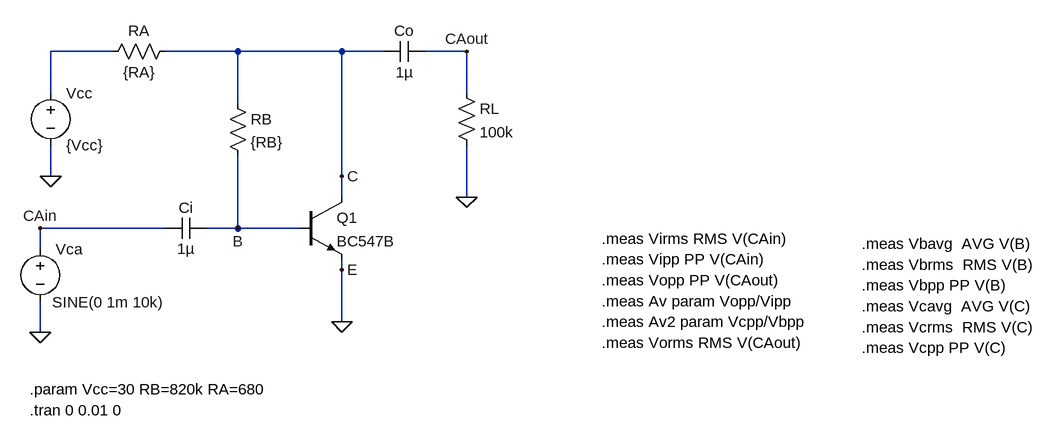
[diagram p0: schematic TBJ04CA.asc]
TBJ04CA.asc, the LTspice schematic file:
Version 4
SHEET 1 1608 1200
WIRE -64 -16 -160 -16
WIRE 128 -16 16 -16
WIRE 288 -16 128 -16
WIRE 352 -16 288 -16
WIRE 480 -16 416 -16
WIRE -160 48 -160 -16
WIRE 480 48 480 -16
WIRE 128 64 128 -16
WIRE -160 176 -160 128
WIRE 288 176 288 -16
WIRE 288 208 288 176
WIRE 480 208 480 128
WIRE 16 256 -176 256
WIRE 128 256 128 144
WIRE 128 256 80 256
WIRE 224 256 128 256
WIRE -176 288 -176 256
WIRE 288 320 288 304
WIRE 288 400 288 320
WIRE -176 416 -176 368
FLAG -160 176 0
FLAG 288 400 0
FLAG -176 416 0
FLAG -176 256 CAin
FLAG 480 208 0
FLAG 480 -16 CAout
FLAG 128 256 B
FLAG 288 176 C
FLAG 288 320 E
SYMBOL res 112 48 R0
SYMATTR InstName RB
SYMATTR Value {RB}
SYMBOL voltage -160 32 R0
WINDOW 123 0 0 Left 0
WINDOW 39 0 0 Left 0
SYMATTR InstName Vcc
SYMATTR Value {Vcc}
SYMBOL npn 224 208 R0
SYMATTR InstName Q1
SYMATTR Value BC547B
SYMBOL cap 80 240 R90
WINDOW 0 0 32 VBottom 2
WINDOW 3 32 32 VTop 2
SYMATTR InstName Ci
SYMATTR Value 1µ
SYMBOL cap 416 -32 R90
WINDOW 0 0 32 VBottom 2
WINDOW 3 32 32 VTop 2
SYMATTR InstName Co
SYMATTR Value 1µ
SYMBOL voltage -176 272 R0
WINDOW 123 0 0 Left 0
WINDOW 39 0 0 Left 0
WINDOW 3 18 98 Left 2
SYMATTR Value SINE(0 1m 10k)
SYMATTR InstName Vca
SYMBOL res 464 32 R0
SYMATTR InstName RL
SYMATTR Value 100k
SYMBOL res 32 -32 R90
WINDOW 0 0 56 VBottom 2
WINDOW 3 32 56 VTop 2
SYMATTR InstName RA
SYMATTR Value {RA}
TEXT -192 536 Left 2 !.tran 0 0.01 0
TEXT -192 504 Left 2 !.param Vcc=30 RB=820k RA=680
TEXT 688 304 Left 2 !.meas Vipp PP V(CAin)
TEXT 688 336 Left 2 !.meas Vopp PP V(CAout)
TEXT 688 368 Left 2 !.meas Av param Vopp/Vipp
TEXT 688 272 Left 2 !.meas Virms RMS V(CAin)
TEXT 1088 344 Left 2 !.meas Vbpp PP V(B)
TEXT 1088 312 Left 2 !.meas Vbrms  RMS V(B)
TEXT 1088 280 Left 2 !.meas Vbavg  AVG V(B)
TEXT 1088 440 Left 2 !.meas Vcpp PP V(C)
TEXT 1088 408 Left 2 !.meas Vcrms  RMS V(C)
TEXT 1088 376 Left 2 !.meas Vcavg  AVG V(C)
TEXT 688 400 Left 2 !.meas Av2 param Vcpp/Vbpp
TEXT 688 432 Left 2 !.meas Vorms RMS V(CAout)

The netlist it stands for:
* TBJ04CA.asc
RB C B {RB}
Vcc N001 0 {Vcc}
Q1 C B 0 0 BC547B
Ci B CAin 1µ
Co CAout C 1µ
Vca CAin 0 SINE(0 1m 10k)
RL CAout 0 100k
RA C N001 {RA}
.model NPN NPN
.model PNP PNP
.lib standard.bjt
.tran 0 0.01 0
.param Vcc=30 RB=820k RA=680
.meas Vipp PP V(CAin)
.meas Vopp PP V(CAout)
.meas Av param Vopp/Vipp
.meas Virms RMS V(CAin)
.meas Vbpp PP V(B)
.meas Vbrms  RMS V(B)
.meas Vbavg  AVG V(B)
.meas Vcpp PP V(C)
.meas Vcrms  RMS V(C)
.meas Vcavg  AVG V(C)
.meas Av2 param Vcpp/Vbpp
.meas Vorms RMS V(CAout)
.backanno
.end